# Altium project exe3.PrjPCB
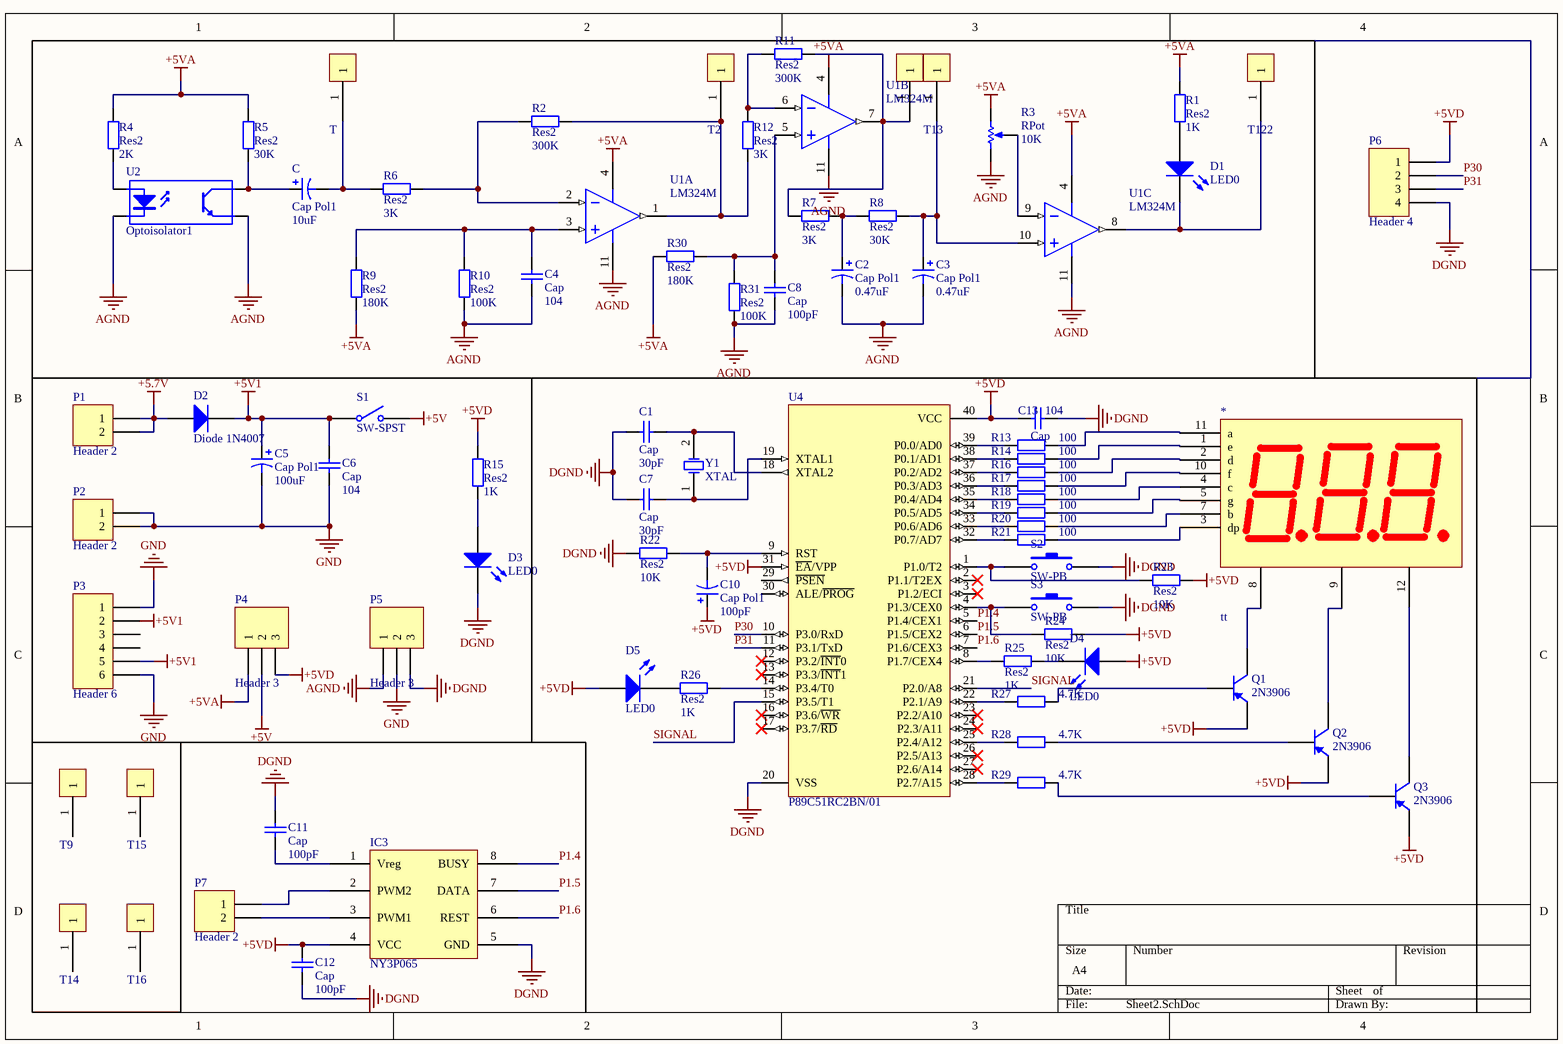
[diagram p0: Sheet2.SchDoc]
1 sheet, 77 parts. Net scope: global (net labels, ports and power ports of the same name join across sheets).
Board file: myy.PcbDoc

## Sheet Sheet2.SchDoc
size A4; SheetNumber: 1; SheetTotal: 1

### Parts
*  tt  [smg]
C  Cap Pol1  value 10uF  [cd-0.1t]
C1  Cap  value 30pF  [C-0.1]
C2  Cap Pol1  value 0.47uF  [cd-0.1t]
C3  Cap Pol1  value 0.47uF  [cd-0.1t]
C4  Cap  value 104  [C-0.1]
C5  Cap Pol1  value 100uF  [CD-0.2T]
C6  Cap  value 104  [C-0.1]
C7  Cap  value 30pF  [C-0.1]
C8  Cap  value 100pF  [C-0.1]
C10  Cap Pol1  value 100pF  [cd-0.1t]
C11  Cap  value 100pF  [C0805R]
C12  Cap  value 100pF  [C0805R]
C13  Cap  value 104  [C-0.1]
D1  LED0  [led5]
D2  Diode 1N4007  [DO-41]
D3  LED0  [led5]
D4  LED0  [led5]
D5  LED0  [led5]
IC3  NY3P065  [sop8]
P1  Header 2  [SIP2]
P2  Header 2  [SIP2]
P3  Header 6  [USBTYPEC6]
P4  Header 3  [JUMP3]
P5  Header 3  [JUMP3]
P6  Header 4  [SIP4]
P7  Header 2  [BEEP2]
Q1  2N3906  [TO92C]
Q2  2N3906  [TO92C]
Q3  2N3906  [TO92C]
R1  Res2  value 1K  [R-0.3]
R2  Res2  value 300K  [R-0.3]
R3  RPot  value 10K  [3362P]
R4  Res2  value 2K  [R-0.3]
R5  Res2  value 30K  [R-0.3]
R6  Res2  value 3K  [R-0.3]
R7  Res2  value 3K  [R-0.3]
R8  Res2  value 30K  [R-0.3]
R9  Res2  value 180K  [R-0.3]
R10  Res2  value 100K  [R-0.3]
R11  Res2  value 300K  [R-0.3]
R12  Res2  value 3K  [R-0.3]
R13  value 100  [R-0.3]
R14  value 100  [R-0.3]
R15  Res2  value 1K  [R-0.3]
R16  value 100  [R-0.3]
R17  value 100  [R-0.3]
R18  value 100  [R-0.3]
R19  value 100  [R-0.3]
R20  value 100  [R-0.3]
R21  value 100  [R-0.3]
R22  Res2  value 10K  [R-0.3]
R23  Res2  value 10K  [R-0.3]
R24  Res2  value 10K  [R-0.3]
R25  Res2  value 1K  [R-0.3]
R26  Res2  value 1K  [R-0.3]
R27  value 4.7K  [R-0.3]
R28  value 4.7K  [R-0.3]
R29  value 4.7K  [R-0.3]
R30  Res2  value 180K  [R-0.3]
R31  Res2  value 100K  [R-0.3]
S1  SW-SPST  [POW3]
S2  SW-PB  [key]
S3  SW-PB  [key]
T  TEST  [SIP1]  (value not drawn)
T2  TEST  [SIP1]  (value not drawn)
T9  TEST  [HLS]  (value not drawn)
T13  TEST  [SIP1]  (value not drawn)
T14  TEST  [HLS]  (value not drawn)
T15  TEST  [HLS]  (value not drawn)
T16  TEST  [HLS]  (value not drawn)
T122  TEST  [SIP1]  (value not drawn)
T21122  TEST  [SIP1]  (value not drawn)
U1  LM324M  [DIP14MY]  (parts A,B,C of 4)
U2  Optoisolator1  [sen]
U4  P89C51RC2BN/01  [DIP40]
Y1  XTAL  [jz]

### Nets
+5.7V: D2.1(A) P1.1 P1.2
+5V: P4.2 S1.2(NO)
+5V1: C5.1 C6.1 D2.2(K) P3.2 P3.5 S1.1(COMMON)
+5VA: P4.1 R1.2 R3.2(BOT) R4.2 R5.2 R9.2 R30.2 U1.4(V+)
+5VD: C10.1 C12.2 C13.1 D4.1(A) D5.1(A) IC3.4(VCC) P4.3 P6.1 Q1.1(E) Q2.1(E) Q3.1(E) R15.1 R23.2 R24.2 U4.31(~{EA}/VPP) U4.40(VCC)
AGND: C2.2 C3.2 C4.1 C8.1 P5.1 R3.1(TOP) R10.2 R31.1 U1.11(GND) U2.2(K) U2.3(E)
DGND: C1.1 C7.2 C11.2 C12.1 C13.2 D3.2(K) IC3.5(GND) P5.3 P6.4 R22.1 S2.2 S3.2 U4.20(VSS)
GND: C5.2 C6.2 P2.1 P2.2 P3.1 P3.6 P5.2
P1.4: IC3.8(BUSY) U4.5(P1.4/CEX1)
P1.5: IC3.7(DATA) U4.6(P1.5/CEX2)
P1.6: IC3.6(REST) U4.7(P1.6/CEX3)
P30: P6.2 U4.10(P3.0/RxD)
P31: P6.3 U4.11(P3.1/TxD)
SIGNAL: U4.15(P3.5/T1) U4.21(P2.0/A8)
Net*_1: *.1(e) R14.2
Net*_2: *.2(d) R16.2
Net*_3: *.3(dp) R21.2
Net*_4: *.4(c) R18.2
Net*_5: *.5(g) R19.2
Net*_7: *.7(b) R20.2
Net*_8: *.8 Q1.3(C)
Net*_9: *.9 Q2.3(C)
Net*_10: *.10(f) R17.2
Net*_11: *.11(a) R13.2
Net*_12: *.12 Q3.3(C)
NetC1_2: C1.2 U4.18(XTAL2) Y1.2(OSC2)
NetC2_1: C2.1 R7.2 R8.1
NetC3_1: C3.1 R8.2 T13.1 U1.10(IN3+)
NetC4_2: C4.2 R9.1 R10.1 U1.3(IN1+)
NetC7_1: C7.1 U4.19(XTAL1) Y1.1(OSC1)
NetC8_2: C8.2 R30.1 R31.2 U1.5(IN2+)
NetC10_2: C10.2 R22.2 U4.9(RST)
NetC11_1: C11.1 IC3.1(Vreg)
NetC_1: C.1 R5.1 U2.4(C)
NetC_2: C.2 R6.1 T.1
NetD1_1: D1.1(A) R1.1
NetD1_2: D1.2(K) T122.1 U1.8(OUT3)
NetD3_1: D3.1(A) R15.2
NetD4_2: D4.2(K) R25.2
NetD5_2: D5.2(K) R26.1
NetIC3_2: IC3.2(PWM2) P7.1
NetIC3_3: IC3.3(PWM1) P7.2
NetQ1_2: Q1.2(B) R27.2
NetQ2_2: Q2.2(B) R28.2
NetQ3_2: Q3.2(B) R29.2
NetR2_1: R2.1 R6.2 U1.2(IN1-)
NetR2_2: R2.2 R12.1 T2.1 U1.1(OUT1)
NetR3_3: R3.3(TAP) U1.9(IN3-)
NetR4_1: R4.1 U2.1(A)
NetR7_1: R7.1 R11.2 T21122.1 U1.7(OUT2)
NetR11_1: R11.1 R12.2 U1.6(IN2-)
NetR13_1: R13.1 U4.39(P0.0/AD0)
NetR14_1: R14.1 U4.38(P0.1/AD1)
NetR16_1: R16.1 U4.37(P0.2/AD2)
NetR17_1: R17.1 U4.36(P0.3/AD3)
NetR18_1: R18.1 U4.35(P0.4/AD4)
NetR19_1: R19.1 U4.34(P0.5/AD5)
NetR20_1: R20.1 U4.33(P0.6/AD6)
NetR21_1: R21.1 U4.32(P0.7/AD7)
NetR23_1: R23.1 S2.1 U4.1(P1.0/T2)
NetR24_1: R24.1 S3.1 U4.4(P1.3/CEX0)
NetR25_1: R25.1 U4.8(P1.7/CEX4)
NetR26_2: R26.2 U4.14(P3.4/T0)
NetR27_1: R27.1 U4.22(P2.1/A9)
NetR28_1: R28.1 U4.25(P2.4/A12)
NetR29_1: R29.1 U4.28(P2.7/A15)

Not connected (* = marked no-connect by the designer): P3 3 4; T9 1; T14 1; T15 1; T16 1; U4 2(P1.1/T2EX)* 3(P1.2/ECI)* 12(P3.2/~{INT}0)* 13(P3.3/~{INT}1)* 16(P3.6/~{WR})* 17(P3.7/~{RD})* 23(P2.2/A10)* 24(P2.3/A11)* 26(P2.5/A13)* 27(P2.6/A14)* 29(~{PSEN}) 30(ALE/~{PROG})

### Library data of the parts
C C2 C3 C5 C10 = Cap Pol1: Polarized Capacitor (Radial); Published: 8-Jun-2000; LatestRevisionDate: 17-Jul-2002; LatestRevisionNote: Re-released for DXP Platform.; PackageReference: RB7.6-15; Publisher: Altium Limited; PackageDescription: Polarized Capacitor (Radial); 2 Leads
C1 C4 C6-C8 C11-C13 = Cap: Capacitor; Published: 8-Jun-2000; LatestRevisionDate: 17-Jul-2002; LatestRevisionNote: Re-released for DXP Platform.; PackageReference: RAD-0.3; Publisher: Altium Limited; PackageDescription: Radial Cap, Thru-Hole; 2 Leads; 0.3 in Pin Spacing
D1 D3-D5 = LED0: Typical INFRARED GaAs LED; Published: 8-Jun-2000; LatestRevisionDate: 08-Jul-2005; LatestRevisionNote: Mech Layer 1 removed.; PackageReference: LED-0; Publisher: Altium Limited; PackageDescription: LED; 2 Leads
D2 = Diode 1N4007: 1 Amp General Purpose Rectifier; Published: 8-Jun-2000; LatestRevisionDate: 17-Jul-2002; LatestRevisionNote: Re-released for DXP Platform.; DatasheetVersion: 1998; PackageVersion: Aug-1999; PackageReference: DO-41; Publisher: Altium Limited; PackageDescription: Diode, Axial; Body 5.2 x 2.7 mm (LxDia. max), Lead Dia. 0.86 mm (max); Code_JEDEC: DO-204-AL; ComponentLink1Description: Manufacturer Link; ComponentLink1URL: http://www.fairchildsemi.com/; ComponentLink2Description: Datasheet; ComponentLink2URL: http://www.fairchildsemi.com/ds/1N%2F1N4001.pdf
IC3 = SOUND
P1 P2 P7 = Header 2: Header, 2-Pin; LatestRevisionDate: 17-Jul-2002; LatestRevisionNote: Re-released for DXP Platform.; Publisher: Altium Limited
P3 = Header 6: Header, 6-Pin; LatestRevisionDate: 17-Jul-2002; LatestRevisionNote: Re-released for DXP Platform.; Publisher: Altium Limited
P4 P5 = Header 3: Header, 3-Pin; LatestRevisionDate: 17-Jul-2002; LatestRevisionNote: Re-released for DXP Platform.; Publisher: Altium Limited
P6 = Header 4: Header, 4-Pin; LatestRevisionDate: 17-Jul-2002; LatestRevisionNote: Re-released for DXP Platform.; Publisher: Altium Limited
Q1-Q3 = 2N3906: PNP General Purpose Amplifier; Published: 8-Jun-2000; LatestRevisionDate: 15-Jan-2003; LatestRevisionNote: PCB Footprint 'BCY-W3/D4.7' replaced; DatasheetVersion: 1997; PackageVersion: Sep-1998; PackageReference: TO-92A; Publisher: Altium Limited; PackageDescription: TO, Flat Index; 3 In-Line, Axial Leads; Body Dia. 4.5mm; Leads 0.51 x 0.48 mm (max); ComponentLink1Description: Manufacturer Link; ComponentLink1URL: http://www.fairchildsemi.com/; ComponentLink2Description: Datasheet; ComponentLink2URL: http://www.fairchildsemi.com/ds/2N%2F2N3906.pdf
R1 R2 R4-R31 = Res2: Resistor; Published: 8-Jun-2000; LatestRevisionDate: 17-Jul-2002; LatestRevisionNote: Re-released for DXP Platform.; PackageReference: AXIAL-0.4; Publisher: Altium Limited; PackageDescription: Axial Device, Thru-Hole; 2 Leads; 0.4 in Pin Spacing
R3 = RPot: Potentiometer; Sim Note: Enter the Resistance value and the set point into parameter fields.; Set Position: 0.5; Published: 8-Jun-2000; LatestRevisionDate: 17-Jul-2002; LatestRevisionNote: Re-released for DXP Platform.; PackageReference: VR5; Publisher: Altium Limited; PackageDescription: Variable Resistor, Thru-Hole; 3 Leads
S1 = SW-SPST: Single-Pole, Single-Throw Switch; Published: 24-Mar-1999; LatestRevisionDate: 17-Jul-2002; LatestRevisionNote: Re-released for DXP Platform.; PackageReference: SPST-2; Publisher: Altium Limited; PackageDescription: Switch; 2 Leads
S2 S3 = SW-PB: Switch; Published: 24-Mar-1999; LatestRevisionDate: 17-Jul-2002; LatestRevisionNote: Re-released for DXP Platform.; PackageReference: SPST-2; Publisher: Altium Limited; PackageDescription: Switch; 2 Leads
U1 = LM324M: Low Power Quad Operational Amplifier; Manufacturer: National Semiconductor; CompType: Amplifiers; PackageTopMarking: NSUZXYTT*LM324M; Published: 4-Dec-2008; LatestRevisionDate: 13-Jan-2009; LatestRevisionNote: Sim Model Added.; DatasheetVersion: Aug-2000; PackageVersion: revJ, Jan-1996; PackageReference: M14A; Publisher: Altium Limited; PackageDescription: Molded Package S.O., .150in Wide, 14 Lead; PartNumber: LM324M; RoHS: O; PinCount: 14; DigiKeyPartNumber: LM324MXCT-ND; Code_JEDEC: MS-012AB; Code_IPC: SOIC127P600-14; ComponentLink1Description: LM324 Datasheet; ComponentLink1URL: http://www.national.com/ds/LM/LM324.pdf; ComponentLink2Description: LM324 Web Page; ComponentLink2URL: http://www.national.com/pf/LM/LM324.html; ComponentLink3Description: M14A Package Page; ComponentLink3URL: http://www.national.com/packaging/folders/m14a.html
U2 = Optoisolator1: 4-Pin Phototransistor Optocoupler; Published: 24-Mar-1999; LatestRevisionDate: 04-Mar-2005; LatestRevisionNote: Sch pins 3 & 4 Swapped.; DatasheetVersion: Nov-2003; PackageReference: DIP-4; Publisher: Altium Limited
U4 = P89C51RC2BN/01: 80C51 8-Bit Flash Microcontroller Family, 32 kB ISP/IAP Flash with 512 B RAM.; Published: 21-May-2003; DatasheetVersion: 18-Jul-2002; PackageVersion: Aug-2000; PackageReference: SOT129-1; Publisher: Altium Limited; PackageDescription: DIP, Plastic; 40 Leads; Row Spacing 15.24 mm; Pitch 2.54 mm; Code_JEDEC: MO-015; ComponentLink1Description: Manufacturer Link; ComponentLink1URL: http://www-us2.semiconductors.philips.com/; ComponentLink2Description: Datasheet; ComponentLink2URL: http://www.semiconductors.philips.com/acrobat/datasheets/P89C51RA2_RB2_RC2_RD2_2.pdf
Y1 = XTAL: Crystal Oscillator; Published: 8-Jun-2000; LatestRevisionDate: 17-Jul-2002; LatestRevisionNote: Re-released for DXP Platform.; PackageReference: R38; Publisher: Altium Limited; PackageDescription: Crystal, Thru-Hole; 2 Leads; Body 3.1 x 8.2 mm (Dia.xH)